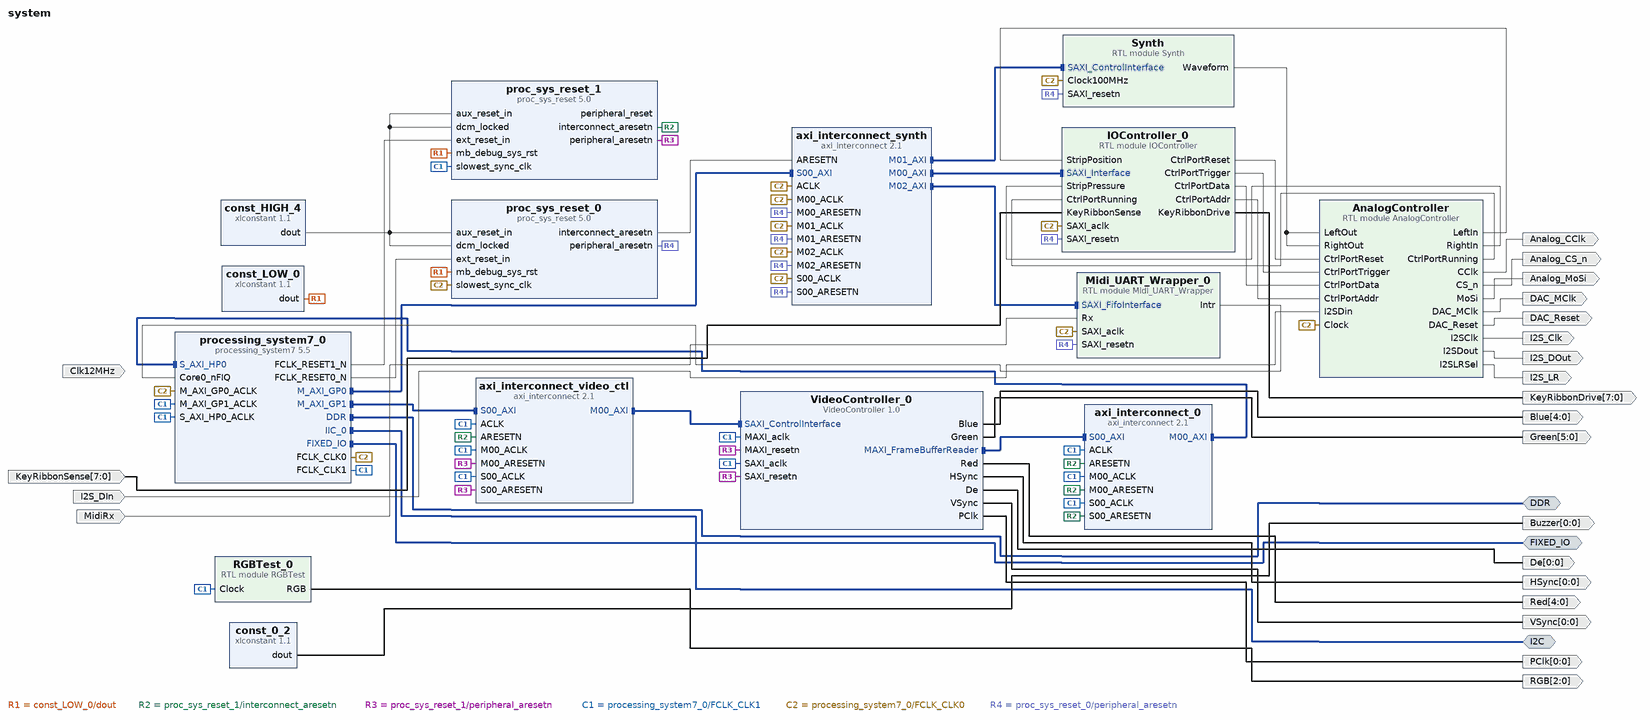
[diagram p0: block diagram of the top level]
# Vivado block design system, xc7z020clg400-2, Vivado 2020.2
create_bd_design system

create_bd_intf_port -mode Master -vlnv xilinx.com:interface:ddrx_rtl:1.0 DDR
create_bd_intf_port -mode Master -vlnv xilinx.com:display_processing_system7:fixedio_rtl:1.0 FIXED_IO
create_bd_intf_port -mode Master -vlnv xilinx.com:interface:iic_rtl:1.0 I2C
create_bd_port -dir O -from 2 -to 0 -type data RGB
create_bd_port -dir O -from 4 -to 0 -type data Red
create_bd_port -dir O -from 5 -to 0 -type data Green
create_bd_port -dir O -from 4 -to 0 -type data Blue
create_bd_port -dir O -from 0 -to 0 -type data HSync
create_bd_port -dir O -from 0 -to 0 -type data VSync
create_bd_port -dir O -from 0 -to 0 -type clk PClk
create_bd_port -dir O -from 0 -to 0 -type data De
create_bd_port -dir O -from 0 -to 0 Buzzer
create_bd_port -dir O -type data I2S_DOut
create_bd_port -dir O -type data I2S_LR
create_bd_port -dir O -type data I2S_Clk
create_bd_port -dir I -type clk Clk12MHz
set_property -dict {CONFIG.FREQ_HZ 12000000} [get_bd_ports Clk12MHz]
create_bd_port -dir O DAC_Reset
create_bd_port -dir O DAC_MClk
create_bd_port -dir I -from 7 -to 0 KeyRibbonSense
create_bd_port -dir O -from 7 -to 0 KeyRibbonDrive
create_bd_port -dir I -type data I2S_DIn
create_bd_port -dir O Analog_CClk
create_bd_port -dir O Analog_MoSi
create_bd_port -dir O Analog_CS_n
create_bd_port -dir I MidiRx

create_bd_cell -type module -reference RGBTest RGBTest_0
create_bd_cell -type ip -vlnv xilinx.com:ip:xlconstant:1.1 const_HIGH_4
create_bd_cell -type ip -vlnv xilinx.com:ip:proc_sys_reset:5.0 proc_sys_reset_0
set_property -dict {CONFIG.C_AUX_RST_WIDTH 2 CONFIG.C_EXT_RST_WIDTH 1} [get_bd_cells proc_sys_reset_0]
create_bd_cell -type ip -vlnv xilinx.com:ip:proc_sys_reset:5.0 proc_sys_reset_1
set_property -dict {CONFIG.C_AUX_RST_WIDTH 2 CONFIG.C_EXT_RST_WIDTH 1} [get_bd_cells proc_sys_reset_1]
create_bd_cell -type ip -vlnv xilinx.com:ip:processing_system7:5.5 processing_system7_0
set_property -dict [list \
  CONFIG.PCW_APU_PERIPHERAL_FREQMHZ 666.666666 \
  CONFIG.PCW_CORE0_FIQ_INTR 1 \
  CONFIG.PCW_CPU_CPU_6X4X_MAX_RANGE 767 \
  CONFIG.PCW_ENET0_PERIPHERAL_ENABLE 0 \
  CONFIG.PCW_EN_CLK1_PORT 1 \
  CONFIG.PCW_EN_RST1_PORT 1 \
  CONFIG.PCW_FCLK_CLK0_BUF FALSE \
  CONFIG.PCW_FCLK_CLK1_BUF TRUE \
  CONFIG.PCW_FPGA0_PERIPHERAL_FREQMHZ 100 \
  CONFIG.PCW_FPGA1_PERIPHERAL_FREQMHZ 149 \
  CONFIG.PCW_FPGA_FCLK1_ENABLE 1 \
  CONFIG.PCW_GPIO_EMIO_GPIO_ENABLE 1 \
  CONFIG.PCW_GPIO_EMIO_GPIO_IO 64 \
  CONFIG.PCW_GPIO_MIO_GPIO_ENABLE 1 \
  CONFIG.PCW_GPIO_MIO_GPIO_IO MIO \
  CONFIG.PCW_I2C0_I2C0_IO EMIO \
  CONFIG.PCW_I2C0_PERIPHERAL_ENABLE 1 \
  CONFIG.PCW_I2C_PERIPHERAL_FREQMHZ 111.111115 \
  CONFIG.PCW_I2C_RESET_ENABLE 1 \
  CONFIG.PCW_I2C_RESET_SELECT {Share reset pin} \
  CONFIG.PCW_PERIPHERAL_BOARD_PRESET None \
  CONFIG.PCW_PRESET_BANK1_VOLTAGE {LVCMOS 1.8V} \
  CONFIG.PCW_QSPI_PERIPHERAL_ENABLE 0 \
  CONFIG.PCW_SD0_GRP_CD_ENABLE 1 \
  CONFIG.PCW_SD0_GRP_CD_IO {MIO 46} \
  CONFIG.PCW_SD0_GRP_WP_ENABLE 1 \
  CONFIG.PCW_SD0_GRP_WP_IO {MIO 47} \
  CONFIG.PCW_SD0_PERIPHERAL_ENABLE 1 \
  CONFIG.PCW_SD0_SD0_IO {MIO 40 .. 45} \
  CONFIG.PCW_SDIO_PERIPHERAL_FREQMHZ 50 \
  CONFIG.PCW_UART1_PERIPHERAL_ENABLE 1 \
  CONFIG.PCW_UART1_UART1_IO {MIO 48 .. 49} \
  CONFIG.PCW_UART_PERIPHERAL_FREQMHZ 100 \
  CONFIG.PCW_UIPARAM_DDR_FREQ_MHZ 533.333333 \
  CONFIG.PCW_UIPARAM_DDR_PARTNO {MT41J256M16 RE-125} \
  CONFIG.PCW_USB0_PERIPHERAL_ENABLE 1 \
  CONFIG.PCW_USB0_RESET_ENABLE 0 \
  CONFIG.PCW_USB0_USB0_IO {MIO 28 .. 39} \
  CONFIG.PCW_USB_RESET_ENABLE 1 \
  CONFIG.PCW_USB_RESET_SELECT {Share reset pin} \
  CONFIG.PCW_USE_FABRIC_INTERRUPT 1 \
  CONFIG.PCW_USE_M_AXI_GP1 1 \
  CONFIG.PCW_USE_S_AXI_HP0 1 \
] [get_bd_cells processing_system7_0]
# 509 more settings of processing_system7_0 are not shown: defaults, MIO pin electricals, DDR timing, and values the tool derives
create_bd_cell -type ip -vlnv xilinx.com:ip:xlconstant:1.1 const_LOW_0
set_property -dict {CONFIG.CONST_VAL 0} [get_bd_cells const_LOW_0]
create_bd_cell -type ip -vlnv xilinx.com:ip:xlconstant:1.1 const_0_2
set_property -dict {CONFIG.CONST_VAL 0} [get_bd_cells const_0_2]
create_bd_cell -type ip -vlnv xilinx.com:ip:axi_interconnect:2.1 axi_interconnect_video_ctl
set_property -dict {CONFIG.ENABLE_ADVANCED_OPTIONS 0 CONFIG.NUM_MI 1} [get_bd_cells axi_interconnect_video_ctl]
create_bd_cell -type ip -vlnv xilinx.com:ip:axi_interconnect:2.1 axi_interconnect_0
set_property -dict {CONFIG.ENABLE_ADVANCED_OPTIONS 1 CONFIG.NUM_MI 1 CONFIG.XBAR_DATA_WIDTH 64} [get_bd_cells axi_interconnect_0]
create_bd_cell -type ip -vlnv xilinx.com:ip:axi_interconnect:2.1 axi_interconnect_synth
set_property -dict {CONFIG.NUM_MI 2 CONFIG.NUM_SI 1} [get_bd_cells axi_interconnect_synth]
create_bd_cell -type ip -vlnv Independant:user:VideoController:1.0 VideoController_0
set_property -dict {CONFIG.SAXI_ID_WIDTH 12 CONFIG.SAXI_SLAVE_BASE_ADDR 0x80000000} [get_bd_cells VideoController_0]
create_bd_cell -type module -reference AnalogController AnalogController
create_bd_cell -type module -reference IOController IOController_0
set_property -dict {CONFIG.SAXI_SLAVE_BASE_ADDR 0x40000000} [get_bd_cells IOController_0]
create_bd_cell -type module -reference Synth Synth
set_property -dict {CONFIG.SAXI_SLAVE_BASE_ADDR 0x60000000} [get_bd_cells Synth]
create_bd_cell -type module -reference Midi_UART_Wrapper Midi_UART_Wrapper_0

# ---- connections ----

connect_bd_intf_net [get_bd_intf_pins VideoController_0/MAXI_FrameBufferReader] [get_bd_intf_pins axi_interconnect_0/S00_AXI]
connect_bd_intf_net [get_bd_intf_ports I2C] [get_bd_intf_pins processing_system7_0/IIC_0]
connect_bd_intf_net [get_bd_intf_pins Synth/SAXI_ControlInterface] [get_bd_intf_pins axi_interconnect_synth/M01_AXI]
connect_bd_intf_net [get_bd_intf_pins IOController_0/SAXI_Interface] [get_bd_intf_pins axi_interconnect_synth/M00_AXI]
connect_bd_intf_net [get_bd_intf_pins axi_interconnect_0/M00_AXI] [get_bd_intf_pins processing_system7_0/S_AXI_HP0]
connect_bd_intf_net [get_bd_intf_ports DDR] [get_bd_intf_pins processing_system7_0/DDR]
connect_bd_intf_net [get_bd_intf_ports FIXED_IO] [get_bd_intf_pins processing_system7_0/FIXED_IO]
connect_bd_intf_net [get_bd_intf_pins axi_interconnect_synth/M02_AXI] [get_bd_intf_pins Midi_UART_Wrapper_0/SAXI_FifoInterface]
connect_bd_intf_net [get_bd_intf_pins axi_interconnect_video_ctl/M00_AXI] [get_bd_intf_pins VideoController_0/SAXI_ControlInterface]
connect_bd_intf_net [get_bd_intf_pins processing_system7_0/M_AXI_GP0] [get_bd_intf_pins axi_interconnect_synth/S00_AXI]
connect_bd_intf_net [get_bd_intf_pins processing_system7_0/M_AXI_GP1] [get_bd_intf_pins axi_interconnect_video_ctl/S00_AXI]
connect_bd_net [get_bd_pins RGBTest_0/RGB] [get_bd_ports RGB]
connect_bd_net -net xlconstant_0_dout [get_bd_pins const_LOW_0/dout] \
  [get_bd_pins proc_sys_reset_0/mb_debug_sys_rst] [get_bd_pins proc_sys_reset_1/mb_debug_sys_rst]
connect_bd_net -net xlconstant_1_dout [get_bd_pins const_HIGH_4/dout] \
  [get_bd_pins proc_sys_reset_0/aux_reset_in] [get_bd_pins proc_sys_reset_0/dcm_locked] \
  [get_bd_pins proc_sys_reset_1/aux_reset_in] [get_bd_pins proc_sys_reset_1/dcm_locked]
connect_bd_net -net ARESETN_1 [get_bd_pins proc_sys_reset_1/interconnect_aresetn] \
  [get_bd_pins axi_interconnect_video_ctl/ARESETN] [get_bd_pins axi_interconnect_0/ARESETN] \
  [get_bd_pins axi_interconnect_0/S00_ARESETN] [get_bd_pins axi_interconnect_0/M00_ARESETN]
connect_bd_net [get_bd_pins processing_system7_0/FCLK_RESET1_N] [get_bd_pins proc_sys_reset_1/ext_reset_in]
connect_bd_net [get_bd_pins proc_sys_reset_1/peripheral_aresetn] \
  [get_bd_pins axi_interconnect_video_ctl/S00_ARESETN] [get_bd_pins axi_interconnect_video_ctl/M00_ARESETN] \
  [get_bd_pins VideoController_0/MAXI_resetn] [get_bd_pins VideoController_0/SAXI_resetn]
connect_bd_net [get_bd_pins const_0_2/dout] [get_bd_ports Buzzer]
connect_bd_net [get_bd_pins processing_system7_0/FCLK_CLK1] \
  [get_bd_pins RGBTest_0/Clock] [get_bd_pins proc_sys_reset_1/slowest_sync_clk] \
  [get_bd_pins processing_system7_0/M_AXI_GP1_ACLK] [get_bd_pins processing_system7_0/S_AXI_HP0_ACLK] \
  [get_bd_pins axi_interconnect_video_ctl/ACLK] [get_bd_pins axi_interconnect_video_ctl/S00_ACLK] \
  [get_bd_pins axi_interconnect_video_ctl/M00_ACLK] [get_bd_pins axi_interconnect_0/ACLK] \
  [get_bd_pins axi_interconnect_0/S00_ACLK] [get_bd_pins axi_interconnect_0/M00_ACLK] \
  [get_bd_pins VideoController_0/MAXI_aclk] [get_bd_pins VideoController_0/SAXI_aclk]
connect_bd_net [get_bd_pins processing_system7_0/FCLK_CLK0] \
  [get_bd_pins proc_sys_reset_0/slowest_sync_clk] [get_bd_pins processing_system7_0/M_AXI_GP0_ACLK] \
  [get_bd_pins axi_interconnect_synth/ACLK] [get_bd_pins axi_interconnect_synth/S00_ACLK] \
  [get_bd_pins axi_interconnect_synth/M00_ACLK] [get_bd_pins axi_interconnect_synth/M01_ACLK] \
  [get_bd_pins AnalogController/Clock] [get_bd_pins IOController_0/SAXI_aclk] [get_bd_pins Synth/Clock100MHz] \
  [get_bd_pins axi_interconnect_synth/M02_ACLK] [get_bd_pins Midi_UART_Wrapper_0/SAXI_aclk]
connect_bd_net [get_bd_pins processing_system7_0/FCLK_RESET0_N] [get_bd_pins proc_sys_reset_0/ext_reset_in]
connect_bd_net [get_bd_pins proc_sys_reset_0/interconnect_aresetn] [get_bd_pins axi_interconnect_synth/ARESETN]
connect_bd_net [get_bd_pins proc_sys_reset_0/peripheral_aresetn] \
  [get_bd_pins axi_interconnect_synth/S00_ARESETN] [get_bd_pins axi_interconnect_synth/M00_ARESETN] \
  [get_bd_pins axi_interconnect_synth/M01_ARESETN] [get_bd_pins IOController_0/SAXI_resetn] [get_bd_pins Synth/SAXI_resetn] \
  [get_bd_pins axi_interconnect_synth/M02_ARESETN] [get_bd_pins Midi_UART_Wrapper_0/SAXI_resetn]
connect_bd_net -net Synth_0_Waveform [get_bd_pins Synth/Waveform] [get_bd_pins AnalogController/LeftOut] [get_bd_pins AnalogController/RightOut]
connect_bd_net -net KeyboarRibbon_1 [get_bd_ports KeyRibbonSense] [get_bd_pins IOController_0/KeyRibbonSense]
# net proc_sys_reset_1_peripheral_reset has one end: proc_sys_reset_1/peripheral_reset
connect_bd_net [get_bd_pins VideoController_0/Red] [get_bd_ports Red]
connect_bd_net [get_bd_pins VideoController_0/Green] [get_bd_ports Green]
connect_bd_net [get_bd_pins VideoController_0/Blue] [get_bd_ports Blue]
connect_bd_net [get_bd_pins VideoController_0/HSync] [get_bd_ports HSync]
connect_bd_net [get_bd_pins VideoController_0/VSync] [get_bd_ports VSync]
connect_bd_net [get_bd_pins VideoController_0/PClk] [get_bd_ports PClk]
connect_bd_net [get_bd_pins VideoController_0/De] [get_bd_ports De]
connect_bd_net -net AnalogController_0_DAC_Reset [get_bd_pins AnalogController/DAC_Reset] [get_bd_ports DAC_Reset]
connect_bd_net -net AnalogController_0_DAC_MClk [get_bd_pins AnalogController/DAC_MClk] [get_bd_ports DAC_MClk]
connect_bd_net -net AnalogController_0_I2SData [get_bd_pins AnalogController/I2SDout] [get_bd_ports I2S_DOut]
connect_bd_net -net AnalogController_0_I2SLRSel [get_bd_pins AnalogController/I2SLRSel] [get_bd_ports I2S_LR]
connect_bd_net -net AnalogController_0_I2SClk [get_bd_pins AnalogController/I2SClk] [get_bd_ports I2S_Clk]
connect_bd_net [get_bd_ports I2S_DIn] [get_bd_pins AnalogController/I2SDin]
connect_bd_net -net AnalogController_0_CClk [get_bd_pins AnalogController/CClk] [get_bd_ports Analog_CClk]
connect_bd_net -net AnalogController_0_MoSi [get_bd_pins AnalogController/MoSi] [get_bd_ports Analog_MoSi]
connect_bd_net -net AnalogController_0_CS_n [get_bd_pins AnalogController/CS_n] [get_bd_ports Analog_CS_n]
connect_bd_net [get_bd_pins IOController_0/CtrlPortReset] [get_bd_pins AnalogController/CtrlPortReset]
connect_bd_net [get_bd_pins IOController_0/CtrlPortTrigger] [get_bd_pins AnalogController/CtrlPortTrigger]
connect_bd_net [get_bd_pins IOController_0/CtrlPortData] [get_bd_pins AnalogController/CtrlPortData]
connect_bd_net [get_bd_pins IOController_0/CtrlPortAddr] [get_bd_pins AnalogController/CtrlPortAddr]
connect_bd_net -net AnalogController_0_LeftIn [get_bd_pins AnalogController/LeftIn] [get_bd_pins IOController_0/StripPosition]
connect_bd_net -net AnalogController_0_RightIn [get_bd_pins AnalogController/RightIn] [get_bd_pins IOController_0/StripPressure]
connect_bd_net -net AnalogController_0_CtrlPortRunning [get_bd_pins AnalogController/CtrlPortRunning] [get_bd_pins IOController_0/CtrlPortRunning]
connect_bd_net [get_bd_pins IOController_0/KeyRibbonDrive] [get_bd_ports KeyRibbonDrive]
connect_bd_net [get_bd_ports MidiRx] [get_bd_pins Midi_UART_Wrapper_0/Rx]
connect_bd_net [get_bd_pins Midi_UART_Wrapper_0/Intr] [get_bd_pins processing_system7_0/Core0_nFIQ]

# ---- address map ----
assign_bd_address -offset 0x40000000 -range 4K -target_address_space [get_bd_addr_spaces processing_system7_0/Data] [get_bd_addr_segs IOController_0/SAXI_Interface/reg0]
assign_bd_address -offset 0x50000000 -range 4K -target_address_space [get_bd_addr_spaces processing_system7_0/Data] [get_bd_addr_segs Midi_UART_Wrapper_0/SAXI_FifoInterface/reg0]
assign_bd_address -offset 0x60000000 -range 512M -target_address_space [get_bd_addr_spaces processing_system7_0/Data] [get_bd_addr_segs Synth/SAXI_ControlInterface/reg0]
assign_bd_address -offset 0x80000000 -range 4K -target_address_space [get_bd_addr_spaces processing_system7_0/Data] [get_bd_addr_segs VideoController_0/SAXI_ControlInterface/Registers]
assign_bd_address -offset 0x10000000 -range 16M -target_address_space [get_bd_addr_spaces VideoController_0/MAXI_FrameBufferReader] [get_bd_addr_segs processing_system7_0/S_AXI_HP0/HP0_DDR_LOWOCM]

validate_bd_design
save_bd_design
